# EAGLE design programmer (EAGLE 9.6.2)
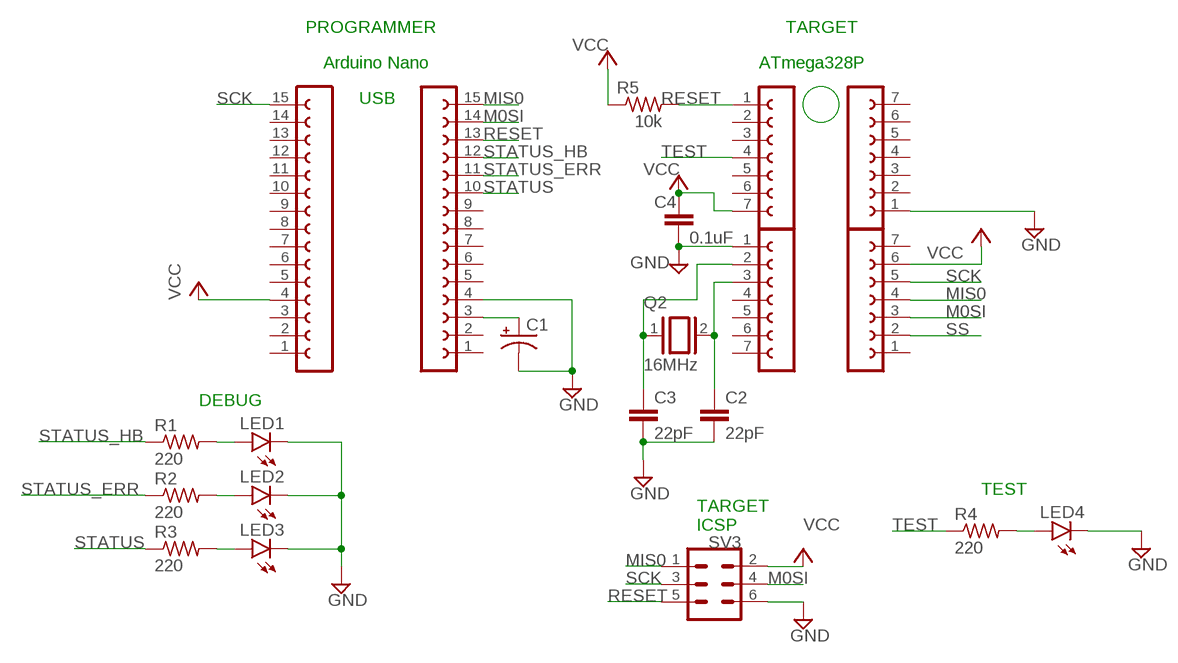
[diagram p0: schematic, sheet 1]

## Parts
C1  CPOL-US153CLV-0405  [153CLV-0405]
C2  22pF  C2,5-3  [C2.5-3]
C3  22pF  C2,5-3  [C2.5-3]
C4  0.1uF  C2,5-3  [C2.5-3]
LED1  LED5MM  [LED5MM]
LED2  LED5MM  [LED5MM]
LED3  LED5MM  [LED5MM]
LED4  LED5MM  [LED5MM]
Q2  16MHz  XTAL/S  [QS]
R1  220  R-US_0207/7  [0207/7]
R2  220  R-US_0207/7  [0207/7]
R3  220  R-US_0207/7  [0207/7]
R4  220  R-US_0207/7  [0207/7]
R5  10k  R-US_0207/7  [0207/7]
SV1  FE15-1  [FE15]
SV2  FE15-1  [FE15]
SV3  MA03-2  [MA03-2]
SV6  FE07-1  [FE07]
SV7  FE07-1  [FE07]
SV8  FE07-1  [FE07]
SV9  FE07-1  [FE07]

## Nets
GND: C1.- C2.2 C3.2 C4.2 LED1.K(C) LED2.K(C) LED3.K(C) LED4.K(C) SV1.4 SV3.6 SV7.1 SV8.1
M0SI: SV1.14 SV3.4 SV9.3
MIS0: SV1.15 SV3.1 SV9.4
N$1: C1.+ SV1.3
N$8: LED1.A R1.2
N$9: LED4.A R4.2
N$10: LED3.A R3.2
N$11: LED2.A R2.2
N$21: C2.1 Q2.2 SV7.3
N$22: C3.1 Q2.1 SV7.2
RESET: R5.2 SV1.13 SV3.5 SV6.1
SCK: SV2.15 SV3.3 SV9.5
SS: SV9.2
STATUS: R3.1 SV1.10
STATUS_ERR: R2.1 SV1.11
STATUS_HB: R1.1 SV1.12
TEST: R4.1 SV6.4
VCC: C4.1 R5.1 SV2.4 SV3.2 SV6.7 SV9.6
Unconnected: SV1.1 SV1.2 SV1.5 SV1.6 SV1.7 SV1.8 SV1.9 SV2.1 SV2.2 SV2.3 SV2.5 SV2.6 SV2.7 SV2.8 SV2.9 SV2.10 SV2.11 SV2.12 SV2.13 SV2.14 SV6.2 SV6.3 SV6.5 SV6.6 SV7.4 SV7.5 SV7.6 SV7.7 SV8.2 SV8.3 SV8.4 SV8.5 SV8.6 SV8.7 SV9.1 SV9.7

## Notes on the sheet
- PROGRAMMER | TARGET
- Arduino Nano | ATmega328P
- USB
- DEBUG
- TEST
- TARGET
  ICSP

## Library data of the parts
C1 = rcl:CPOL-US: POLARIZED CAPACITOR, American symbol; SPICEPREFIX: C
C2-C4 = capacitor-wima:C: CAPACITOR naming: grid - package width
LED1-LED4 = led:LED: LED OSRAM: - CHIPLED LG R971, LG N971, LY N971, LG Q971, LY Q971, LO R971, LY R971 LH N974, LH R974 LS Q976, LO Q976, LY Q976 LO Q996 - Hyper CHIPLED LW Q18S LB Q993, LB Q99A, LB R99A - SideLED LS A670, LO A670, LY A670, LG A670, LP A670 LB A673, LV A673, LT A673, LW A673 LH A674 LY A675 LS A676, LA A676, LO A676, LY A676, LW A676 LS A679, LY A679, LG A679 - Hyper Micro SIDELED® LS Y876, LA Y876, LO Y876, LY Y876 LT Y87S - SmartLED LW L88C, LW L88S LB L89C, LB L89S, LG L890 LS L89K, LO L89K, LY L89K LS L896, LA L896, LO L896, LY L896 - TOPLED LS T670, LO T670, LY T670, LG T670, LP T670 LSG T670, LSP T670, LSY T670, LOP T670, LYG T670 LG T671, LOG T671, LSG T671 LB T673, LV T673, LT T673, LW T673 LH T674 LS T676, LA T676, LO T676, LY T676, LB T676, LH T676, LSB T676, LW T676 LB T67C, LV T67C, LT T67C, LS T67K, LO T67K, LY T67K, LW E67C LS E67B, LA E67B, LO E67B, LY E67B, LB E67C, LV E67C, LT E67C LW T67C LS T679, LY T679, LG T679 LS T770, LO T770, LY T770, LG T770, LP T770 LB T773, LV T773, LT T773, LW T773 LH T774 LS E675, LA E675, LY E675, LS T675 LS T776, LA T776, LO T776, LY T776, LB T776 LHGB T686 LT T68C, LB T68C - Hyper Mini TOPLED® LB M676 - Mini TOPLED Santana® LG M470 LS M47K, LO M47K, LY M47K Source: http://www.osram.convergy.de LUXEON: - LUMILED® LXK2-PW12-R00, LXK2-PW12-S00, LXK2-PW14-U00, LXK2-PW14-V00 LXK2-PM12-R00, LXK2-PM12-S00, LXK2-PM14-U00 LXK2-PE12-Q00, LXK2-PE12-R00, LXK2-PE12-S00, LXK2-PE14-T00, LXK2-PE14-U00 LXK2-PB12-K00, LXK2-PB12-L00, LXK2-PB12-M00, LXK2-PB14-N00, LXK2-PB14-P00, LXK2-PB14-Q00 LXK2-PR12-L00, LXK2-PR12-M00, LXK2-PR14-Q00, LXK2-PR14-R00 LXK2-PD12-Q00, LXK2-PD12-R00, LXK2-PD12-S00 LXK2-PH12-R00, LXK2-PH12-S00 LXK2-PL12-P00, LXK2-PL12-Q00, LXK2-PL12-R00 Source: www.luxeon.com KINGBRIGHT: KA-3528ASYC Source: www.kingbright.com
Q2 = special:XTAL/S: CRYSTAL
R1-R5 = rcl:R-US_: RESISTOR, American symbol; SPICEPREFIX: R
SV1 SV2 = con-lsta:FE15-1: FEMALE HEADER; OC_FARNELL: unknown; OC_NEWARK: unknown
SV3 = con-lstb:MA03-2: PIN HEADER; OC_FARNELL: unknown; OC_NEWARK: unknown
SV6-SV9 = con-lsta:FE07-1: FEMALE HEADER; OC_FARNELL: unknown; OC_NEWARK: unknown

## Board
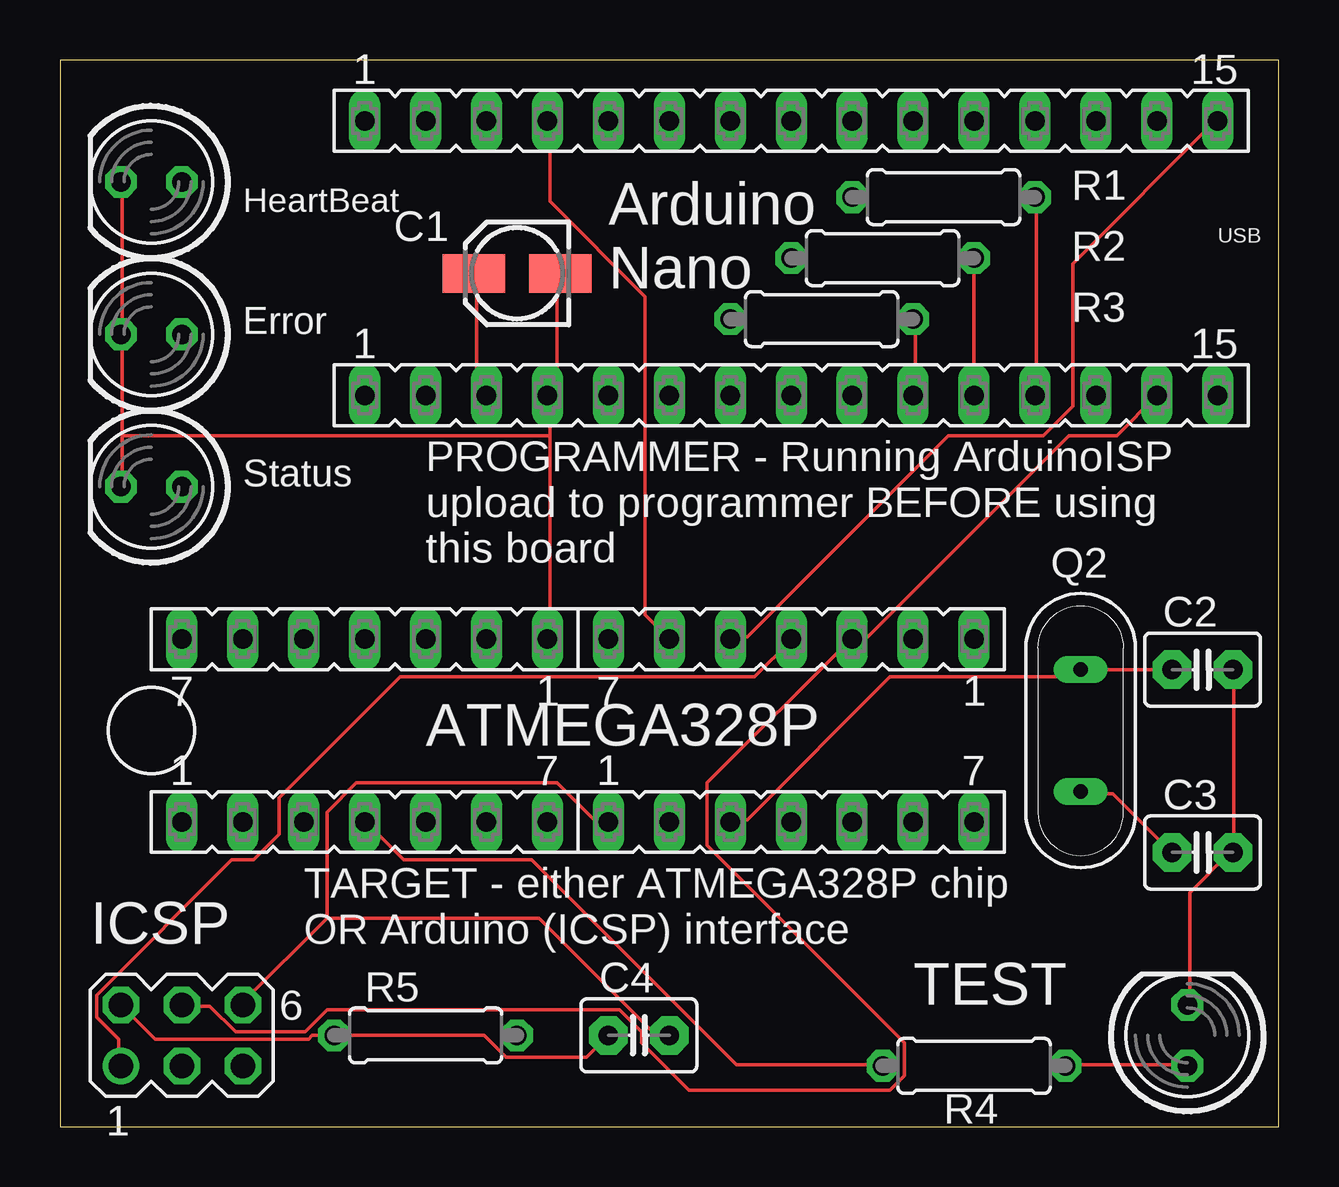
[diagram p1: board, top side]
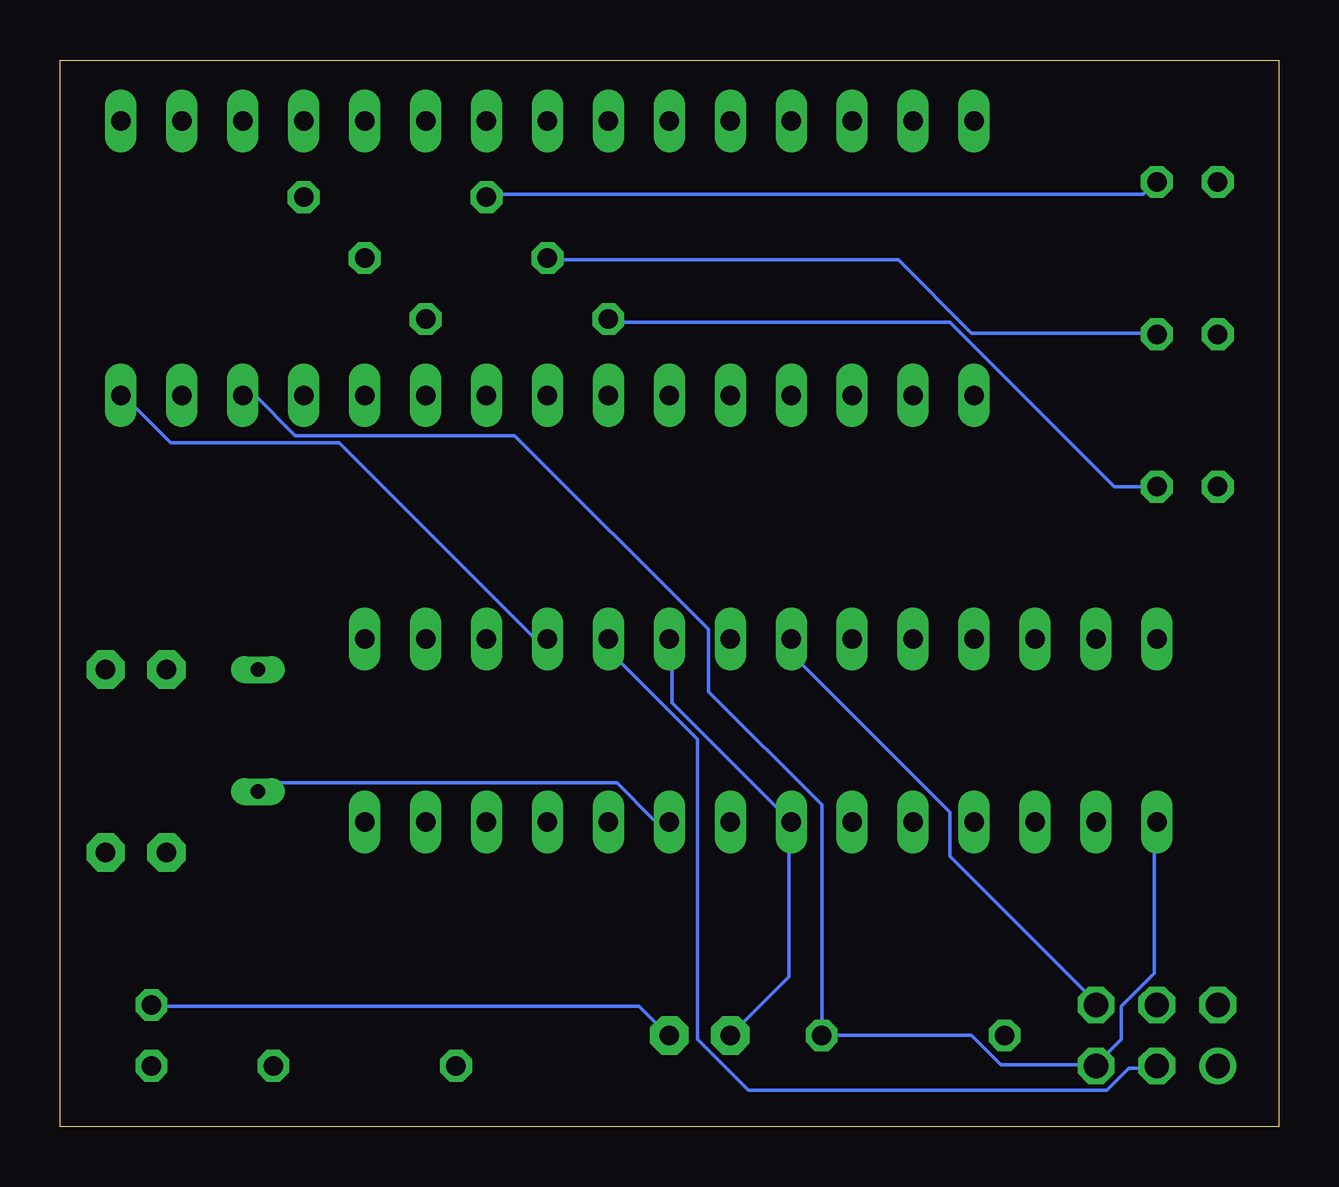
[diagram p2: board, bottom side, seen from below]

Size 50.8 x 44.45 mm. Coordinates in mm from the lower left corner, seen from the top.
Outline: 0,0 50.8,0 50.8,44.45 0,44.45 0,0
Copper layers (1*16): Top 0.035mm / dielectric 1.5mm / Bottom 0.035mm
Design rules "default": minimum track width 6mil, minimum drill 0.35mm, track to track 6mil, track to pad 6mil, pad to pad 6mil, via to via 6mil, smd to smd 6mil, copper to edge 40mil, drill to drill 6mil, minimum pad ring 10mil, minimum via ring 8mil, stop-mask expansion 4mil, vias tented up to drill 0mil, thermal gap 10mil

### Footprints (pad centres in the part's own frame; a part is rotated, then mirrored left to right if it is on the bottom)
153CLV-0405 = smd 2.6 x 1.6: + 1.8,0; - -1.8,0
C2.5-3 = drill 0.813 pad 1.6 octagon: 1 -1.27,0; 2 1.27,0
LED5MM = drill 0.813 octagon: A -1.27,0; K 1.27,0
QS = drill 0.61 long: 1 -2.54,0; 2 2.54,0
0207/7 = drill 0.813 octagon: 1 -3.81,0; 2 3.81,0
FE15 = drill 0.813 long: 1 -17.78,0; 2 -15.24,0; 3 -12.7,0; 4 -10.16,0; 5 -7.62,0; 6 -5.08,0; 7 -2.54,0; 8 0,0; 9 2.54,0; 10 5.08,0; 11 7.62,0; 12 10.16,0; 13 12.7,0; 14 15.24,0; 15 17.78,0
MA03-2 = drill 1.016: 1 -2.54,-1.27 | drill 1.016 octagon: 2 -2.54,1.27; 3 0,-1.27; 4 0,1.27; 5 2.54,-1.27; 6 2.54,1.27
FE07 = drill 0.813 long: 1 -7.62,0; 2 -5.08,0; 3 -2.54,0; 4 0,0; 5 2.54,0; 6 5.08,0; 7 7.62,0

### Placement (x,y rotation side)
C1  19.05,35.56 180 top
C2  47.62,19.05 0 top
C3  47.62,11.43 0 top
C4  24.13,3.81 0 top
LED1  3.81,39.37 180 top
LED2  3.81,33.02 180 top
LED3  3.81,26.67 180 top
LED4  46.99,3.81 90 top
Q2  42.55,16.51 90 top
R1  36.83,38.73 180 top
R2  34.29,36.2 180 top
R3  31.75,33.66 180 top
R4  38.1,2.54 0 top
R5  15.24,3.81 0 top
SV1  30.48,30.48 0 top
SV2  30.48,41.91 0 top
SV3  5.08,3.81 0 top
SV6  12.7,12.7 0 top
SV7  30.48,12.7 0 top
SV8  12.7,20.32 180 top
SV9  30.48,20.32 180 top

### Tracks (layer width: path | path; a pad name or v marks a point on that pad's centre or on a via)
GND
  Top 0.152: 2.59,28.8 2.59,32.92 LED2.K 2.59,33.07 2.59,39.32 LED1.K | 2.59,28.8 2.59,26.67 LED3.K | 20.42,30.48 20.73,30.79 20.73,35.51 C1.- | 20.42,30.48 20.42,28.8 | 20.42,28.8 20.42,20.42 SV8.1 | 20.42,30.48 SV1.4 | 20.42,28.8 2.59,28.8 | LED4.K 47.09,5.18 47.09,9.75 48.77,11.43 C3.2 48.92,11.43 48.92,19.05 C2.2 | 11.12,8.69 11.12,13.11 12.34,14.33 20.73,14.33 22.25,12.8 22.86,12.8 SV7.1 | 11.12,8.69 7.62,5.18 SV3.6 | C4.2 24.84,3.81 19.96,8.69 11.12,8.69
  Bottom 0.152: LED4.K 46.94,5.03 26.67,5.03 25.45,3.81 C4.2 | SV8.1 20.27,20.27 20.27,19.66 13.72,13.11 13.72,11.28 7.62,5.18 SV3.6
M0SI
  Top 0.152: SV1.14 44.04,28.8 42.06,28.8 33.68,20.42 33.07,20.42 SV9.3 32.92,20.27 26.98,14.33 26.98,11.73 35.2,3.5 35.2,2.13 34.59,1.52 26.21,1.52 24.23,3.5 24.23,3.96 23.32,4.88 11.12,4.88 10.21,3.96 7.32,3.96 6.25,5.03 5.18,5.03 SV3.4
MIS0
  Top 0.152: SV3.1 2.44,2.59 2.44,3.66 1.52,4.57 1.52,5.49 7.16,11.12 8.08,11.12 9.14,12.19 9.14,13.72 14.17,18.75 28.96,18.75 30.48,20.27 SV9.4
  Bottom 0.152: SV9.4 30.48,20.42 31.09,20.42 39.17,28.5 46.18,28.5 48.16,30.48 SV1.15
N$1
  Top 0.152: C1.+ 17.37,35.51 17.37,30.79 17.68,30.48 SV1.3
N$8
  Bottom 0.152: R1.2 32.92,38.86 5.64,38.86 5.18,39.32 LED1.A
N$9
  Top 0.152: R4.2 41.91,2.59 46.94,2.59 LED4.A
N$10
  Bottom 0.152: LED3.A 6.86,26.67 13.72,33.53 27.89,33.53 R3.2
N$11
  Bottom 0.152: LED2.A 5.18,33.07 12.8,33.07 15.85,36.12 30.48,36.12 R2.2
N$21
  Top 0.152: C2.1 Q2.2 42.52,19.05 42.22,18.75 34.59,18.75 28.65,12.8 28.04,12.8 SV7.3
N$22
  Top 0.152: Q2.1 42.67,13.87 43.89,13.87 46.33,11.43 C3.1
  Bottom 0.152: SV7.2 25.45,12.8 26.06,12.8 27.58,14.33 42.22,14.33 42.52,14.02 Q2.1
RESET
  Bottom 0.152: 7.62,2.59 6.55,3.66 6.55,5.03 5.18,6.4 5.18,12.65 SV6.1 | 7.62,2.59 11.58,2.59 12.8,3.81 R5.2 19.05,13.41 23.77,18.14 23.77,20.73 31.85,28.8 41,28.8 42.67,30.48 SV1.13 | 7.62,2.59 SV3.5
SCK
  Top 0.152: SV9.5 28.04,20.42 28.65,20.42 37.03,28.8 41,28.8 42.22,30.02 42.22,35.97 48.16,41.91 SV2.15
  Bottom 0.152: SV3.3 5.18,2.44 6.25,2.44 7.16,1.52 22.1,1.52 24.23,3.66 24.23,16.15 27.89,19.81 27.89,20.27 SV9.5
STATUS
  Top 0.152: SV1.10 35.66,30.48 35.66,33.53 R3.1
STATUS_ERR
  Top 0.152: R2.1 SV1.11
STATUS_HB
  Top 0.152: SV1.12 40.69,30.48 40.69,38.71 R1.1
TEST
  Top 0.152: R4.1 34.29,2.59 28.19,2.59 19.66,11.12 14.33,11.12 12.8,12.65 SV6.4
VCC
  Top 0.152: SV3.2 3.96,3.66 10.36,3.66 10.52,3.81 R5.1 17.68,3.81 18.59,2.9 21.95,2.9 C4.1 | SV9.6 24.38,21.34 24.38,34.59 20.42,38.56 20.42,41.91 SV2.4
  Bottom 0.152: C4.1 20.42,6.25 20.42,12.65 SV6.7 25.3,17.68 25.3,20.27 SV9.6

### Text on the board
tPlace: HeartBeat | USB | Arduino / Nano | Error | Status | PROGRAMMER - Running ArduinoISP / upload to programmer BEFORE using / this board | ATMEGA328P | ICSP | TARGET - either ATMEGA328P chip / OR Arduino (ICSP) interface | TEST